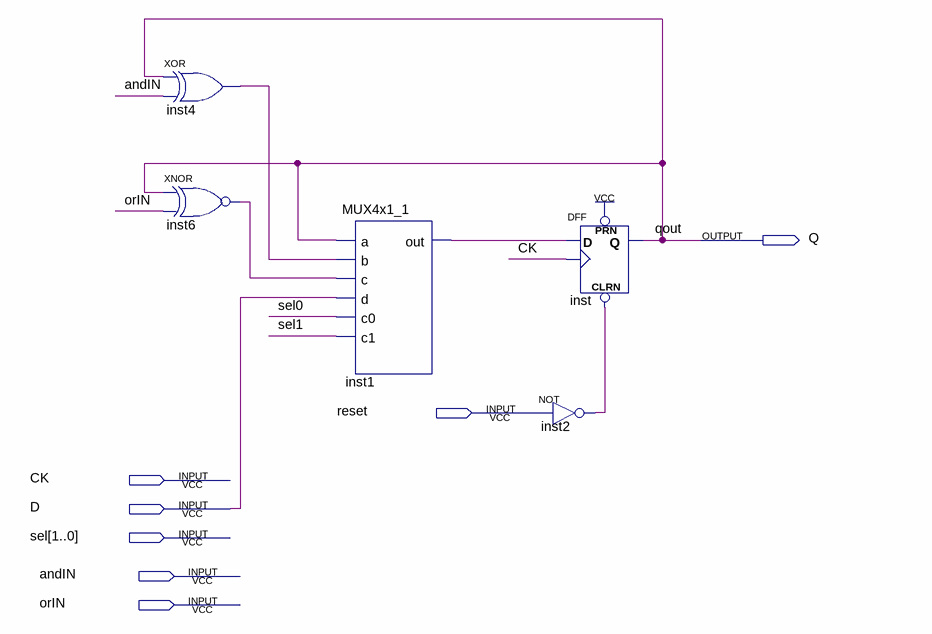
[diagram p0: schematic sheet]
// Quartus schematic Contador1_bit.bdf as structural Verilog: 5 symbols, 7 pins
module Contador1_bit (
  input  reset,
  input  CK,
  input  D,
  input  [1:0] sel,
  input  andIN,
  input  orIN,
  output Q
);

  wire inst1_out, inst2_out, inst4_out, inst6_out;

  xor inst4 (inst4_out, Q, andIN);
  xnor inst6 (inst6_out, Q, orIN);
  MUX4x1_1 inst1 (.a(Q), .b(inst4_out), .c(inst6_out), .d(D), .c0(sel[0]), .c1(sel[1]), .out(inst1_out));
  not inst2 (inst2_out, reset);
  DFF inst (.CLRN(inst2_out), .CLK(CK), .D(inst1_out), .PRN(1'b1), .Q(Q));

  // Other names for the same wires on the sheet: qout = Q
endmodule
